# EasyEDA Pro project PCB工程文件.epro

# Schematic 原理图
Board Name: Board1; Create Date: 2025-06-18; Page Name: P1; Project Name: 串口透镜; Schematic Name: 原理图; Update Date: 2025-06-19; Drawed: Fantastair; Page Size: A4; Reviewed: Fantastair; Version: V1.0
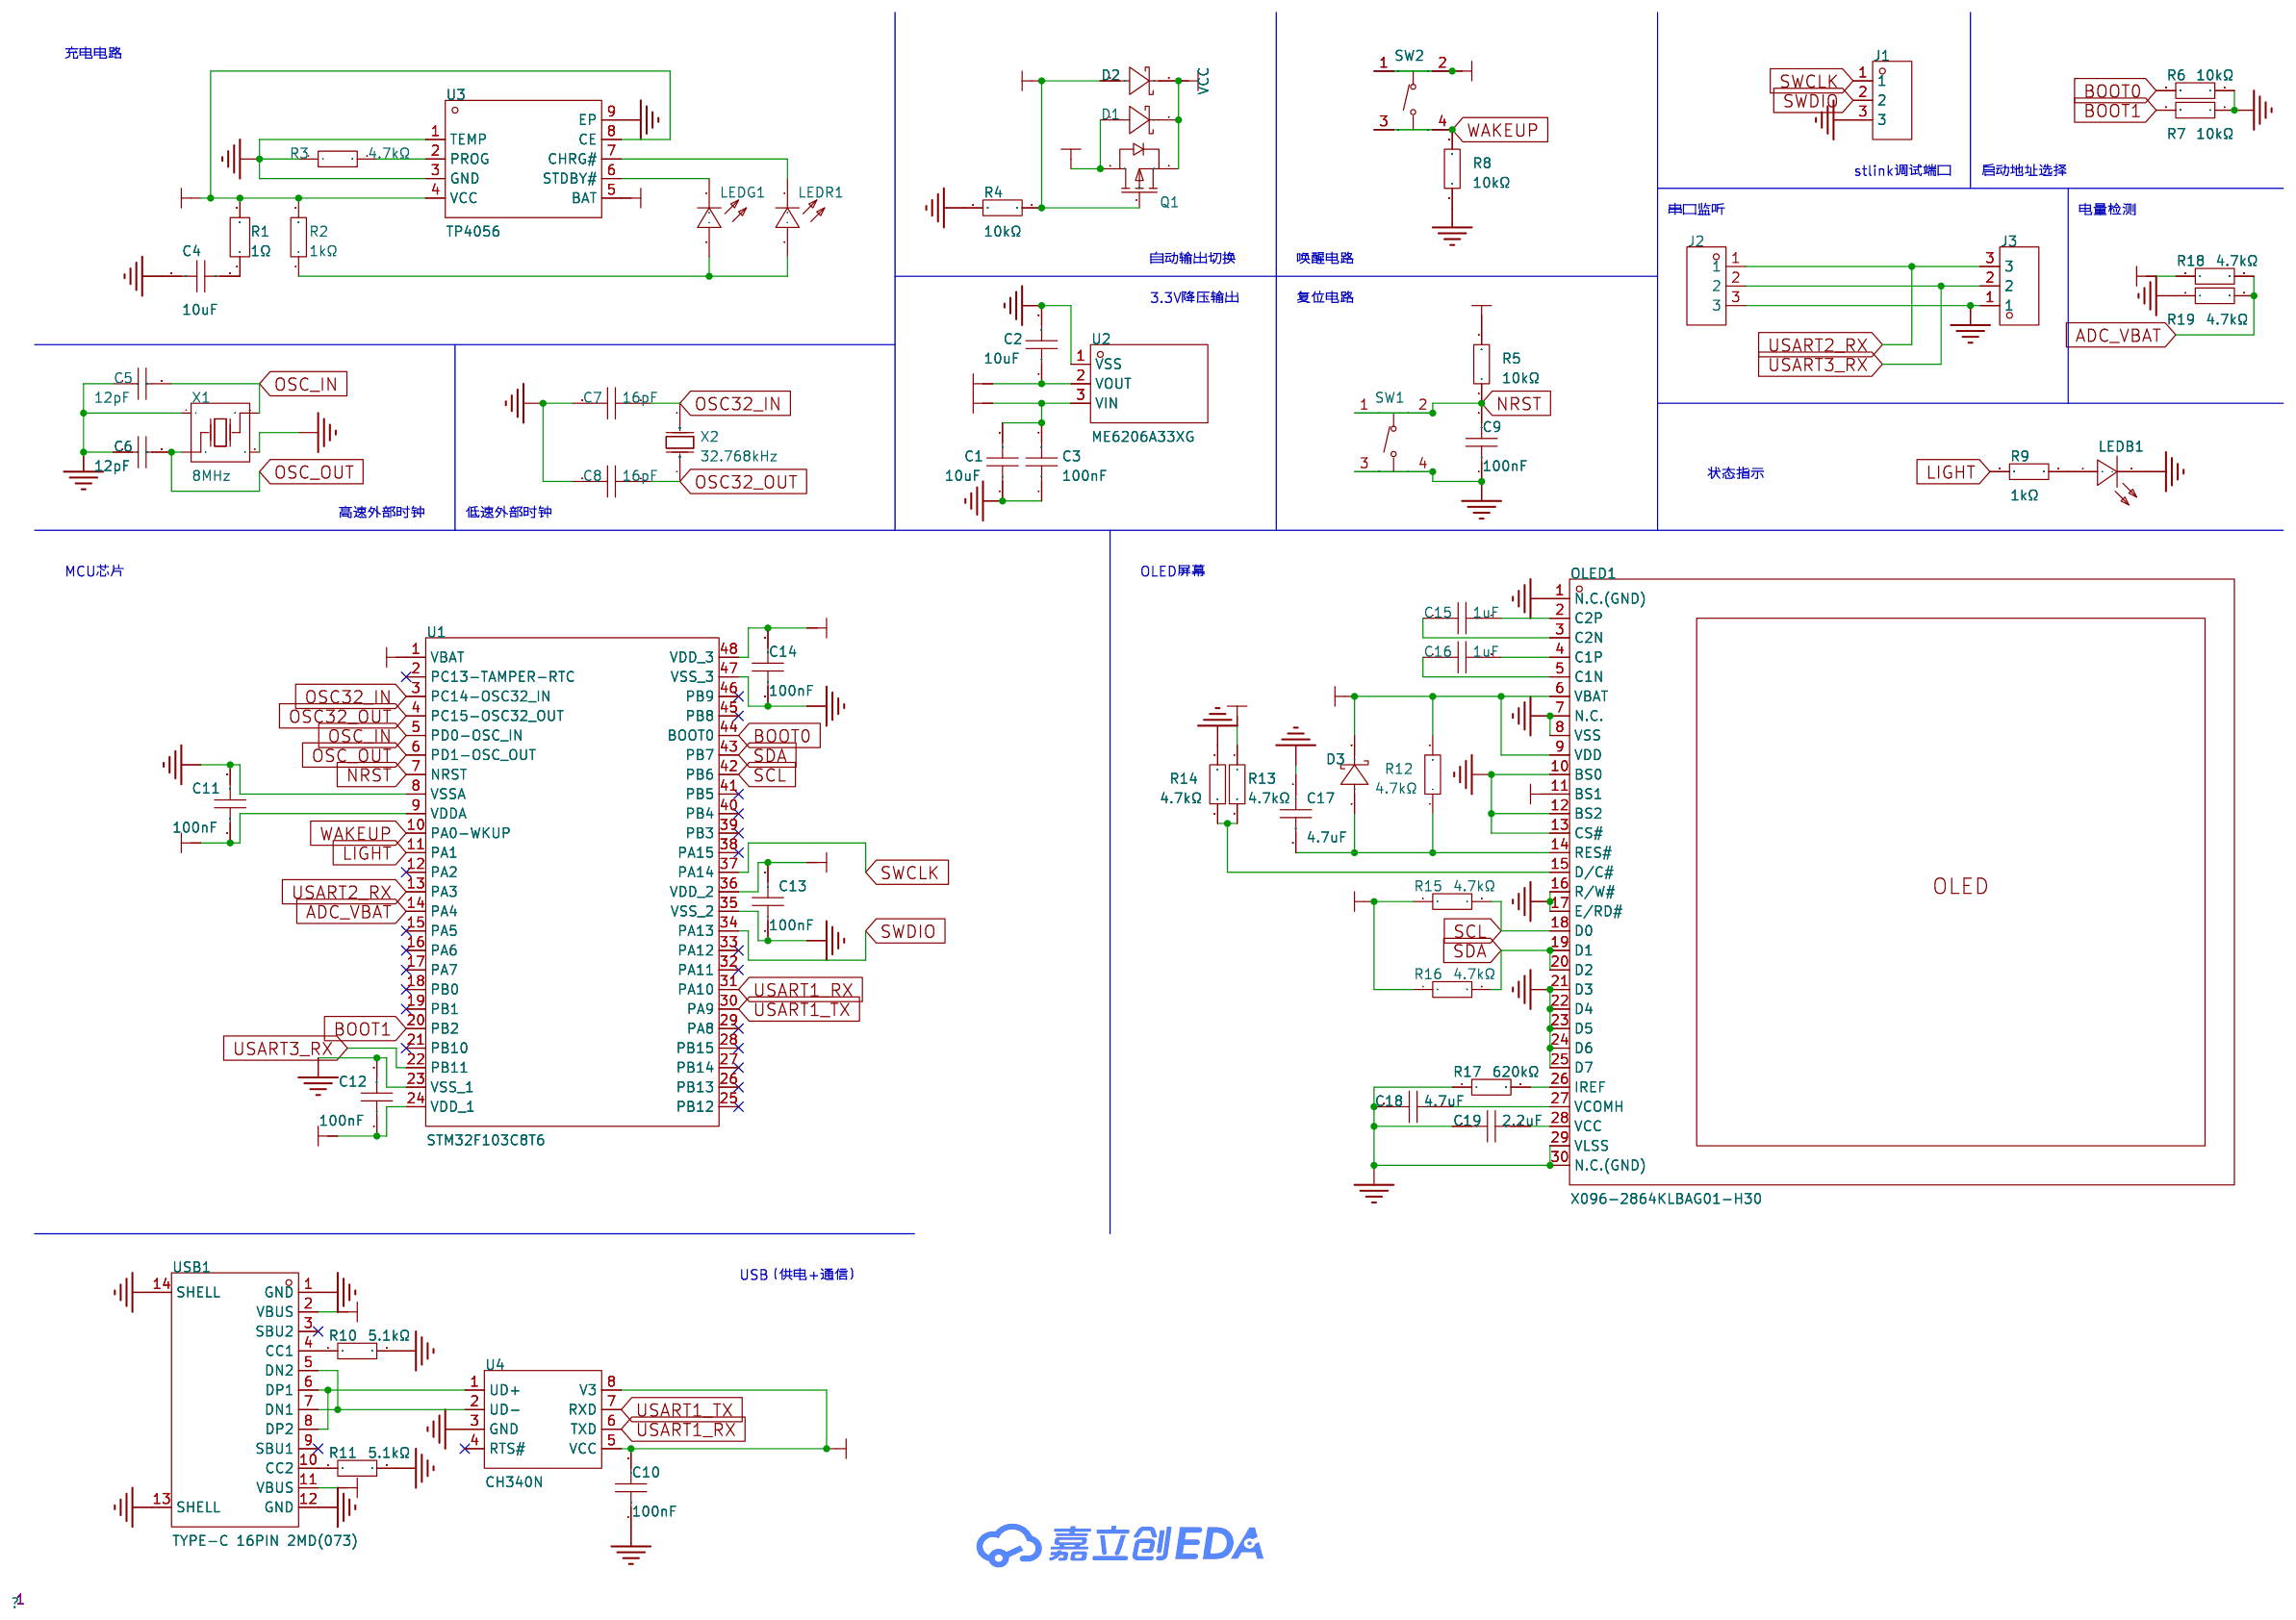
[diagram p0: schematic sheet]

## Parts
C1  10uF  [C0603]
C2  10uF  [C0603]
C3  100nF  [C0603]
C4  10uF  [C0603]
C5  12pF  [C0603]
C6  12pF  [C0603]
C7  16pF  [C0603]
C8  16pF  [C0603]
C9  100nF  [C0603]
C10  100nF  [C0603]
C11  100nF  [C0603]
C12  100nF  [C0603]
C13  100nF  [C0603]
C14  100nF  [C0603]
C15  1uF  [C0603]
C16  1uF  [C0603]
C17  4.7uF  [C0603]
C18  4.7uF  [C0603]
C19  2.2uF  [C0603]
D1  DSK14  [SOD-123_L2.8-W1.8-LS3.7-FD]
D2  DSK14  [SOD-123_L2.8-W1.8-LS3.7-FD]
D3  DSK14  [SOD-123_L2.8-W1.8-LS3.7-FD]
J1  X6511FRS-03-C85D30  [HDR-SMD_3P-P2.54-H-F-L11.5]
J2  X6511FRS-03-C85D30  [HDR-SMD_3P-P2.54-H-F-L11.5]
J3  X6511FRS-03-C85D30  [HDR-SMD_3P-P2.54-H-F-L11.5]
LEDB1  NCD0805B2  [LED0805-R-RD]
LEDG1  NCD0603G1  [LED0603-RD_1]
LEDR1  NCD0603R1  [LED0603-RD_RED]
OLED1  X096-2864KLBAG01-H30  [OLED-SMD_X096-2864KLBAG01-H30]
Q1  SI2301S  [SOT-23-3_L2.9-W1.3-P0.95-LS2.4-BR]
R1  1Ω  [R0603]
R2  1kΩ  [R0603]
R3  4.7kΩ  [R0603]
R4  10kΩ  [R0603]
R5  10kΩ  [R0603]
R6  10kΩ  [R0603]
R7  10kΩ  [R0603]
R8  10kΩ  [R0603]
R9  1kΩ  [R0603]
R10  5.1kΩ  [R0603]
R11  5.1kΩ  [R0603]
R12  4.7kΩ  [R0603]
R13  4.7kΩ  [R0603]
R14  4.7kΩ  [R0603]
R15  4.7kΩ  [R0603]
R16  4.7kΩ  [R0603]
R17  620kΩ  [R0603]
R18  4.7kΩ  [R0603]
R19  4.7kΩ  [R0603]
SW1  TS-1187A-B-A-B  [SW-SMD_4P-L5.1-W5.1-P3.70-LS6.5-TL_H1.5]
SW2  TS-1187A-B-A-B  [SW-SMD_4P-L5.1-W5.1-P3.70-LS6.5-TL_H1.5]
U1  STM32F103C8T6  [LQFP-48_L7.0-W7.0-P0.50-LS9.0-BL]
U2  ME6206A33XG  [SOT-23-3_L2.9-W1.6-P1.90-LS2.8-BR]
U3  TP4056  [ESOP-8_L4.9-W3.9-P1.27-LS6.0-BL-EP]
U4  CH340N  [SOP-8_L4.9-W3.9-P1.27-LS6.0-BL]
USB1  TYPE-C 16PIN 2MD(073)  [USB-C-SMD_TYPE-C-6PIN-2MD-073]
X1  8MHz  [CRYSTAL-SMD_4P-L3.2-W2.5-BL]
X2  32.768kHz  [CRYSTAL-SMD_L3.2-W1.5-1]

## Library data of the parts
C1 C2 C4 = CL10A106KP8NNNC: 容值:10uF;精度:±10%;额定电压:10V;材质(温度系数):X5R;; LCSC Part Name: 10uF ±10% 10V; Supplier Part: C19702; Manufacturer: SAMSUNG(三星); Supplier Footprint: 0603; JLCPCB Part Class: 基础库; Datasheet: https://atta.szlcsc.com/upload/public/pdf/source/20160218/1457707763339.pdf; Supplier: LCSC; Tolerance: ±10%; Voltage Rated: 10V; Temperature Coefficient: X5R
C3 C9-C14 = CGA0603X7R104K500JT: 容值:100nF;精度:±10%;额定电压:50V;温度系数:X7R;; LCSC Part Name: 100nF ±10% 50V; Supplier Part: C6119867; Manufacturer: HRE(芯声); Supplier Footprint: 0603; JLCPCB Part Class: 扩展库; Datasheet: https://atta.szlcsc.com/upload/public/pdf/source/20250103/C44077DA9E7B3EFAE02F22B6D3D1CBC9.pdf; Supplier: LCSC; Tolerance: ±10%; Voltage Rating: 50V; Temperature Coefficient: X7R
C5 C6 = CL10C120JB8NNNC: 容值:12pF;精度:±5%;额定电压:50V;材质(温度系数):C0G;; LCSC Part Name: 12pF ±5% 50V; Supplier Part: C38523; Manufacturer: SAMSUNG(三星); Supplier Footprint: 0603; JLCPCB Part Class: 基础库; Datasheet: https://atta.szlcsc.com/upload/public/pdf/source/20160218/1457707763339.pdf; Supplier: LCSC; Tolerance: ±5%; Voltage Rated: 50V; Temperature Coefficient: C0G
C7 C8 = CC0603JRNPO9BN160: 容值:16pF;精度:±5%;额定电压:50V;材质(温度系数):NP0;; LCSC Part Name: 16pF ±5% 50V; Supplier Part: C327125; Manufacturer: YAGEO(国巨); Supplier Footprint: 0603; JLCPCB Part Class: 扩展库; Datasheet: https://atta.szlcsc.com/upload/public/pdf/source/20181031/C327125_89E7808AEF80EBF49C6D347D2684BD80.pdf; Supplier: LCSC; Tolerance: ±5%; Voltage Rated: 50V; Temperature Coefficient: NP0
C15 C16 = CL10A105KB8NNNC: 容值:1uF;精度:±10%;额定电压:50V;材质(温度系数):X5R;; LCSC Part Name: 1uF ±10% 50V; Supplier Part: C15849; Manufacturer: SAMSUNG(三星); Supplier Footprint: 0603; JLCPCB Part Class: 基础库; Datasheet: https://atta.szlcsc.com/upload/public/pdf/source/20160218/1457707763339.pdf; Supplier: LCSC; Tolerance: ±10%; Voltage Rated: 50V; Temperature Coefficient: X5R
C17 C18 = CL10A475KO8NNNC: 容值:4.7uF;精度:±10%;额定电压:16V;材质(温度系数):X5R;; LCSC Part Name: 4.7uF ±10% 16V; Supplier Part: C19666; Manufacturer: SAMSUNG(三星); Supplier Footprint: 0603; JLCPCB Part Class: 基础库; Datasheet: https://atta.szlcsc.com/upload/public/pdf/source/20160218/1457707763339.pdf; Supplier: LCSC; Tolerance: ±10%; Voltage Rated: 16V; Temperature Coefficient: X5R
C19 = CL10A225KB8NNNC: 容值:2.2uF;精度:±10%;额定电压:50V;材质(温度系数):X5R;; LCSC Part Name: 2.2uF ±10% 50V; Supplier Part: C913904; Manufacturer: SAMSUNG(三星); Supplier Footprint: 0603; JLCPCB Part Class: 扩展库; Datasheet: https://atta.szlcsc.com/upload/public/pdf/source/20160218/1457707763339.pdf; Supplier: LCSC; Tolerance: ±10%; Voltage Rated: 50V; Temperature Coefficient: X5R
D1-D3 = DSK14_C908228: 二极管配置:-;正向压降(Vf):550mV@1A;直流反向耐压(Vr):40V;平均整流电流(Io):1A;; LCSC Part Name: 电压:40V 电流:1A; Supplier Part: C908228; Manufacturer: FUXINSEMI(富芯森美); Supplier Footprint: SOD-123; JLCPCB Part Class: 扩展库; Datasheet: https://atta.szlcsc.com/upload/public/pdf/source/20201027/C908227_56774C7FA3F54032F9E299E0F5E1A587.pdf; Supplier: LCSC; Forward Voltage (Vf@If): 550mV@1A; Reverse Voltage (Vr): 40V; Average Rectified Current (Io): 1A; Reverse Leakage Current (Ir): 500uA
J1-J3 = X6511FRS-03-C85D30: 插孔结构:1x3P;间距:2.54mm;安装类型:卧贴;排数:单排;总孔位数:3P;塑高:8.5mm;; LCSC Part Name: 间距:2.54mm 1x3P 卧贴; Supplier Part: C5142236; Manufacturer: XKB Connectivity(中国星坤); Supplier Footprint: SMD,P=2.54mm,卧贴; JLCPCB Part Class: 扩展库; Datasheet: https://atta.szlcsc.com/upload/public/pdf/source/20220822/AB9A82E80C220285963E5EFA3BFD32FF.pdf; Supplier: LCSC; Holes Structure: 1x3P; Pitch: 2.54mm; Mounting Type: 卧贴; Number of Rows: 单排; Number of Holes: 3P; Insulation Height: 8.5mm
LEDB1 = NCD0805B2: 发光颜色:蓝色;正向电压(VF):2.5V~3.6V;功率:72mW;正向电流:2mA;主波长:468nm~478nm;透镜颜色:无色透明透镜;发光强度:20mcd~55mcd;发光角度:130°;工作温度:-30℃~+85℃;; Supplier Part: C84259; Manufacturer: 国星光电; Supplier Footprint: 0805; JLCPCB Part Class: 扩展库; Datasheet: https://atta.szlcsc.com/upload/public/pdf/source/20200820/C84259_E5AC6865415989C4C2C2831134BA3A23.pdf; Supplier: LCSC; Emitted Color: 蓝色; Forward Voltage (VF): 2.5V~3.6V; Power Dissipation: 72mW; Forward Current: 2mA; Dominant Wavelength: 468nm~478nm; Lens Color: 无色透明透镜; Luminous Intensity: 20mcd~55mcd; Viewing Angle: 130°; Operating Temperature: -30℃~+85℃
LEDG1 = NCD0603G1: 发光颜色:翠绿色;正向压降(Vf):2.6V~3.6V;功率:72mW;正向电流:20mA;波长:515nm~530nm;透镜颜色:-;发光强度:330mcd~900mcd;发光角度:130°;工作温度:-30℃~+85℃;; Supplier Part: C84267; Manufacturer: 国星光电; Supplier Footprint: 0603; JLCPCB Part Class: 扩展库; Datasheet: https://atta.szlcsc.com/upload/public/pdf/source/20200820/C84267_04BA7703640BAC111D09F5EFB971FBF3.pdf; Supplier: LCSC; Illumination Color: 翠绿色; Voltage - Forward(Vf): 2.6V~3.6V; Power(Watts): 72mW; Forward Current: 20mA; Wavelength - Dominant: 515nm~530nm; Luminous Intensity: 330mcd~900mcd; Viewing Angle: 130°; Operating Temperature: -30℃~+85℃
LEDR1 = NCD0603R1_C84263: 灯头类型:-;发光颜色:红色;正向压降(Vf):1.6V~2.6V;功率:65mW;正向电流:25mA;波长:615nm~630nm;二极管配置:独立二极管;透镜颜色:-;色温:-;发光强度:80mcd~220mcd;发光角度:130°;载带方式:-;工作温度:-30℃~+85℃;; Supplier Part: C84263; Manufacturer: 国星光电; Supplier Footprint: 0603; JLCPCB Part Class: 扩展库; Datasheet: https://atta.szlcsc.com/upload/public/pdf/source/20200820/C84263_DABC6A75E58F576973B407FDBA283D60.pdf; Supplier: LCSC; Illumination Color: 红色; Voltage - Forward(Vf): 1.6V~2.6V; Power(Watts): 65mW; Forward Current: 25mA; Wavelength - Dominant: 615nm~630nm; Diode Configuration: 独立二极管; Luminous Intensity: 80mcd~220mcd; Viewing Angle: 130°; Operating Temperature: -30℃~+85℃
OLED1 = X096-2864KLBAG01-H30: 主控芯片:SSD1315;尺寸(inch):0.96;像素分辨率:128x64;; LCSC Part Name: 0.96寸 蓝光 128x64像素分辨率 30PIN; Supplier Part: C4944144; Manufacturer: Newvision(新智景); JLCPCB Part Class: 扩展库; Datasheet: https://atta.szlcsc.com/upload/public/pdf/source/20220811/AFF42A01440844B6AF7EF5D26E15DF13.pdf; Supplier: LCSC; Main Control Chip: SSD1315; Size: 0.96; Pixel Resolution: 128x64; Operating Temperature: -40℃~+85℃
Q1 = SI2301S_C18186231: 类型:-;漏源电压(Vdss):20V;连续漏极电流(Id):2.3A;导通电阻(RDS(on)):142mΩ@2.5V,2A;耗散功率(Pd):-;阈值电压(Vgs(th)):400mV;; LCSC Part Name: 1个P沟道 耐压:20V 电流:2.3A; Supplier Part: C18186231; Manufacturer: GOODWORK(固得沃克); Supplier Footprint: SOT-23; Datasheet: https://atta.szlcsc.com/upload/public/pdf/source/20230919/7D45853AF69EB0E0671E02D1B59DE28B.pdf; Supplier: LCSC; Drain to Source Voltage: 20V; Current - Continuous Drain(Id): 2.3A; RDS(on): 142mΩ@2.5V,2A; Gate Threshold Voltage (Vgs(th)@Id): 400mV; Gate Charge(Qg): 10nC@4.5V; Input Capacitance(Ciss@Vds): 405pF; Reverse Transfer Capacitance (Crss@Vds): 55pF; Operating Temperature: -50℃~+150℃
R1 = FRC0603J1R0 TS: 电阻类型:厚膜电阻;阻值:1Ω;精度:±5%;功率:100mW;最大工作电压:75V;温度系数:±200ppm/℃;; LCSC Part Name: 1Ω ±5% 100mW 厚膜电阻; Supplier Part: C2907116; Manufacturer: FOJAN(富捷); Supplier Footprint: 0603; JLCPCB Part Class: 扩展库; Datasheet: https://atta.szlcsc.com/upload/public/pdf/source/20211221/925EC7D7225764EE0046F22065062C87.pdf; Supplier: LCSC; Type: 厚膜电阻; Tolerance: ±5%; Power(Watts): 100mW; Overload Voltage (Max): 75V; Temperature Coefficient: ±200ppm/℃; Operating Temperature Range: -55℃~+155℃
R2 R9 = 0603WAF1001T5E: 电阻类型:厚膜电阻;阻值:1kΩ;精度:±1%;功率:100mW;最大工作电压:75V;温度系数:±100ppm/℃;; LCSC Part Name: 1kΩ ±1% 100mW 厚膜电阻; Supplier Part: C21190; Manufacturer: UNI-ROYAL(厚声); Supplier Footprint: 0603; JLCPCB Part Class: 基础库; Datasheet: https://atta.szlcsc.com/upload/public/pdf/source/20200306/C422600_1E6D84923E4A46A82E41ADD87F860B5C.pdf; Supplier: LCSC; Type: 厚膜电阻; Tolerance: ±1%; Power(Watts): 100mW; Overload Voltage (Max): 75V; Temperature Coefficient: ±100ppm/℃; Operating Temperature Range: -55℃~+155℃
R3 R12-R16 R18 R19 = 0603WAF4701T5E: 电阻类型:厚膜电阻;阻值:4.7kΩ;精度:±1%;功率:100mW;最大工作电压:75V;温度系数:±100ppm/℃;; LCSC Part Name: 4.7kΩ ±1% 100mW 厚膜电阻; Supplier Part: C23162; Manufacturer: UNI-ROYAL(厚声); Supplier Footprint: 0603; JLCPCB Part Class: 基础库; Datasheet: https://atta.szlcsc.com/upload/public/pdf/source/20200306/C422600_1E6D84923E4A46A82E41ADD87F860B5C.pdf; Supplier: LCSC; Type: 厚膜电阻; Tolerance: ±1%; Power(Watts): 100mW; Overload Voltage (Max): 75V; Temperature Coefficient: ±100ppm/℃; Operating Temperature Range: -55℃~+155℃
R4-R8 = 0603WAF1002T5E: 电阻类型:厚膜电阻;阻值:10kΩ;精度:±1%;功率:100mW;最大工作电压:75V;温度系数:±100ppm/℃;; LCSC Part Name: 厚膜电阻 10kΩ ±1% 100mW; Supplier Part: C25804; Manufacturer: UNI-ROYAL(厚声); Supplier Footprint: 0603; JLCPCB Part Class: 基础库; Datasheet: https://atta.szlcsc.com/upload/public/pdf/source/20200306/C422600_1E6D84923E4A46A82E41ADD87F860B5C.pdf; Supplier: LCSC; Type: 厚膜电阻; Tolerance: ±1%; Power(Watts): 100mW; Overload Voltage (Max): 75V; Temperature Coefficient: ±100ppm/℃; Operating Temperature Range: -55℃~+155℃
R10 R11 = ETCR0603F5K10K9: 阻值:5.1kΩ;精度:±1%;功率:100mW;; LCSC Part Name: 5.1kΩ ±1% 100mW; Supplier Part: C365441; Manufacturer: RESI(开步睿思); Supplier Footprint: 0603; JLCPCB Part Class: 扩展库; Datasheet: https://atta.szlcsc.com/upload/public/pdf/source/20190121/C365476_1D4B5F4656D455B591196F27522394C2.pdf; Supplier: LCSC; Tolerance: ±1%; Power(Watts): 100mW
R17 = 0603WAF6203T5E: 电阻类型:厚膜电阻;阻值:620kΩ;精度:±1%;功率:100mW;最大工作电压:75V;温度系数:±100ppm/℃;; LCSC Part Name: 620kΩ ±1% 100mW 厚膜电阻; Supplier Part: C23219; Manufacturer: UNI-ROYAL(厚声); Supplier Footprint: 0603; JLCPCB Part Class: 扩展库; Datasheet: https://atta.szlcsc.com/upload/public/pdf/source/20200306/C422600_1E6D84923E4A46A82E41ADD87F860B5C.pdf; Supplier: LCSC; Type: 厚膜电阻; Tolerance: ±1%; Power(Watts): 100mW; Overload Voltage (Max): 75V; Temperature Coefficient: ±100ppm/℃; Operating Temperature Range: -55℃~+155℃
SW1 SW2 = TS-1187A-B-A-B: 电路结构:单刀单掷;按钮形状:圆形按钮;作用力:160gf;安装方式:立贴;开关长度:5.1mm;开关宽度:5.1mm;开关高度:1.5mm;带支架:不带;触点电流:50mA;额定电压(DC):12V;绝缘电阻:-;带灯:无;机械寿命:10万次;; LCSC Part Name: 5.1*5.1*1.5mm 立贴 轻触开关; Supplier Part: C318884; Manufacturer: XKB Connectivity(中国星坤); Supplier Footprint: SMD; JLCPCB Part Class: 基础库; Datasheet: https://atta.szlcsc.com/upload/public/pdf/source/20200227/C318890_053E50208A88A7BA1965D8746000774E.pdf; Supplier: LCSC; Circuit: 单刀单掷; Actuator Style: 圆形按钮; Operating Force: 160gf; Mounting Style: 立贴; Switch Length: 5.1mm; Switch Width: 5.1mm; Switch Height: 1.5mm; Strike Gundam: 不带; Contact Current: 50mA; Voltage Rating (DC): 12V; Actuator/Cap Color: 金色; With Lamp: 无; Mechanical Life: 10万次; Operating Temperature: -30℃~+85℃
U1 = STM32F103C8T6: CPU内核:ARM-M3;CPU最大主频:72MHz;应用领域:-;; LCSC Part Name: 主流增强型ARM Cortex-M3 MCU，具有64 KB Flash、72 MHz CPU、电机控制、USB和CAN; Supplier Part: C8734; Manufacturer: ST(意法半导体); Supplier Footprint: LQFP-48(7x7); JLCPCB Part Class: 扩展库; Datasheet: https://atta.szlcsc.com/upload/public/pdf/source/20220812/8363ACEC51AD55ECEB84799464F7CB85.pdf; Supplier: LCSC; CPU Core: ARM-M3; CPU Maximum Speed: 72MHz; Program Storage Size: 64KB; Program Memory Type: FLASH; Number of I/O: 37; ADC (Bit): 12bit; Voltage - Supply: 2V~3.6V
U2 = ME6206A33XG: 输出类型:固定;最大输入电压:6V;输出电压:3.3V;最大输出电流:300mA;电源纹波抑制比(PSRR):50dB@(1kHz);输出极性:正极;; LCSC Part Name: 输入6V 输出3.3V 300mA; Supplier Part: C161345; Manufacturer: MICRONE(南京微盟); Supplier Footprint: SOT-23; JLCPCB Part Class: Extended Part; Datasheet: https://atta.szlcsc.com/upload/public/pdf/source/20180207/C161345_15179949863651359188.pdf; Supplier: LCSC; Output Type: 固定; Maximum Input Voltage: 6V; Output Voltage: 3.3V; MAX Output Current: 300mA; Power Supply Rejection Ratio (PSRR): 50dB@(1kHz); Dropout Voltage: 400mV@(200mA); Output Polarity: 正极; Number of Outputs: 1
U3 = TP4056_C382139: 工作电压:4V~6V;最大充电电流:1A;电池类型:锂离子/聚合物;电池节数:1;; LCSC Part Name: 1A锂电池充电IC; Supplier Part: C382139; Manufacturer: TPOWER(天源); Supplier Footprint: ESOP-8; JLCPCB Part Class: 扩展库; Datasheet: https://atta.szlcsc.com/upload/public/pdf/source/20190327/C382139_EC85960E6FE3E26856C240C81751A184.pdf; Supplier: LCSC; The Chip Type: 线性充电芯片; Supply Voltage: 4V~6V; Maximum Charge Current: 1A; Charging Saturation Voltage: 4.2V; Type of Battery: 锂离子/聚合物; Number of Cells: 1; Operating Temperature: -40℃~+85℃
U4 = CH340N: 应用功能:USB转串口;接口协议:USB 2.0;通道数:1;数据速率:2Mbps;; LCSC Part Name: USB2.0芯片CH340; Supplier Part: C2977777; Manufacturer: WCH(南京沁恒); Supplier Footprint: SOP-8; JLCPCB Part Class: 扩展库; Datasheet: https://atta.szlcsc.com/upload/public/pdf/source/20240313/115CDE92081B1D6CB446704AD5D0F5F2.pdf; Supplier: LCSC; Applications Function: USB转串口; Protocol: USB 2.0; Number of Channels: 1; Voltage - Supply: 3.3V；5V; Data Rate: 2Mbps; Operating Temperature: -20℃~+70℃
USB1 = TYPE-C 16PIN 2MD(073): 连接器类型:Type-C;标准:USB 3.1;公母:母;安装方式:卧贴;触点数量:16P;端口数量:1;额定电流 - 电源:5A;工作温度范围:-25℃~+85℃;; LCSC Part Name: Type-C 母 卧贴; Supplier Part: C2765186; Manufacturer: SHOU HAN(首韩); Supplier Footprint: SMD; JLCPCB Part Class: Extended Part; Datasheet: https://atta.szlcsc.com/upload/public/pdf/source/20211123/39B17C16241EAC15C5E277BDA434118E.pdf; Supplier: LCSC; Connector Type: Type-C; Standard: USB 3.1; Gender: 母; Mounting Style: 卧贴; Number of Contacts: 16P; Number of Ports: 1; Current Rating - Power (Max): 5A; Operating Temperature Range: -25℃~+85℃; Rated Voltage (Max): 5V; Connect-Disconnect Life: 5千次; Core Colour: 黑色
X1 = TAXM8M4RDBCCT2T: 晶振类型:贴片晶振;频率:8MHz;常温频差:±10ppm;负载电容:10pF;频率稳定度:±15ppm;; LCSC Part Name: 8MHz ±10ppm 10pF; Supplier Part: C400090; Manufacturer: YJX(雅晶鑫); Supplier Footprint: SMD3225-4P; JLCPCB Part Class: 扩展库; Datasheet: https://atta.szlcsc.com/upload/public/pdf/source/20190626/C400090_CF95B89E745AFE4EF2E392EF8AC009D6.pdf; Supplier: LCSC; Type: 贴片晶振; Normal temperature Frequency Tolerance: ±10ppm; Load Capacitance: 10pF; Frequency Stability: ±15ppm; Equivalent Series Resistance(ESR): 250Ω; Operating Temperature: -40℃~+85℃
X2 = XKXGI-SUA-32.768K: 晶振类型:贴片晶振;频率:32.768kHz;常温频差:±20ppm;负载电容:12.5pF;频率稳定度:±30ppm;; LCSC Part Name: YST310S 32.768KHZ 2P 3215 12.5PF ±20PPM -40~85℃; Supplier Part: C5213671; Manufacturer: YXC(扬兴晶振); Supplier Footprint: SMD3215-2P; JLCPCB Part Class: 扩展库; Datasheet: https://atta.szlcsc.com/upload/public/pdf/source/20240329/3A7650FD985DD0DE85694D3785AB4916.pdf; Supplier: LCSC; Type: 贴片晶振; Normal temperature Frequency Tolerance: ±20ppm; Load Capacitance: 12.5pF; Frequency Stability: ±30ppm; Operating Temperature: -40℃~+85℃

## Nets
3V3: C2.1 C10.2 C11.1 C12.1 C13.2 C14.2 D3.2(K) OLED1.6(VBAT) OLED1.9(VDD) OLED1.11(BS1) R5.2 R12.2 R13.1 R15.1 R16.1 SW2.1(A) SW2.2(B) U1.1(VBAT) U1.9(VDDA) U1.24(VDD_1) U1.36(VDD_2) U1.48(VDD_3) U2.2(VOUT) U4.5(VCC) U4.8(V3)
5V: D2.1(A) Q1.1(G) R1.2 R2.2 R4.1 U3.4(VCC) U3.8(CE) USB1.2(VBUS) USB1.11(VBUS)
GND: C1.1 C2.2 C3.1 C4.2 C5.1 C6.1 C7.2 C8.2 C9.1 C10.1 C11.2 C12.2 C13.1 C14.1 C17.1 C18.2 C19.1 J1.3 J2.3 J3.1 LEDB1.2(-) OLED1.1(N.C.(GND)) OLED1.7(N.C.) OLED1.8(VSS) OLED1.10(BS0) OLED1.12(BS2) OLED1.13(CS#) OLED1.16(R/W#) OLED1.17(E/RD#) OLED1.21(D3) OLED1.22(D4) OLED1.23(D5) OLED1.24(D6) OLED1.25(D7) OLED1.29(VLSS) OLED1.30(N.C.(GND)) R3.1 R4.2 R6.1 R7.1 R8.1 R10.2 R11.2 R14.1 R17.1 R19.1 SW1.3(C) SW1.4(D) U1.8(VSSA) U1.23(VSS_1) U1.35(VSS_2) U1.47(VSS_3) U2.1(VSS) U3.1(TEMP) U3.3(GND) U3.9(EP) U4.3(GND) USB1.1(GND) USB1.12(GND) USB1.13(SHELL) USB1.14(SHELL) X1.2 X1.4
VCC: C1.2 C3.2 D1.2(K) D2.2(K) Q1.2(S) U2.3(VIN)
ADC_VBAT: R18.2 R19.2 U1.14(PA4)
BOOT0: R6.2 U1.44(BOOT0)
BOOT1: R7.2 U1.20(PB2)
LIGHT: R9.2 U1.11(PA1)
NRST: C9.2 R5.1 SW1.1(A) SW1.2(B) U1.7(NRST)
OSC32_IN: C7.1 U1.3(PC14-OSC32_IN) X2.2(OSC2)
OSC32_OUT: C8.1 U1.4(PC15-OSC32_OUT) X2.1(OSC1)
OSC_IN: C5.2 U1.5(PD0-OSC_IN) X1.3
OSC_OUT: C6.2 U1.6(PD1-OSC_OUT) X1.1
SCL: OLED1.18(D0) R15.2 U1.42(PB6)
SDA: OLED1.19(D1) OLED1.20(D2) R16.2 U1.43(PB7)
SWCLK: J1.1 U1.37(PA14)
SWDIO: J1.2 U1.34(PA13)
USART1_RX: U1.31(PA10) U4.6(TXD)
USART1_TX: U1.30(PA9) U4.7(RXD)
USART2_RX: J2.1 J3.3 U1.13(PA3)
USART3_RX: J2.2 J3.2 U1.22(PB11)
V_BAT: D1.1(A) Q1.3(D) R18.1 U3.5(BAT)
WAKEUP: R8.2 SW2.3(C) SW2.4(D) U1.10(PA0-WKUP)
$1N1063: C4.1 R1.1
$1N1376: LEDG1.2(A) LEDR1.2(A) R2.1
$1N1506: R3.2 U3.2(PROG)
$1N2036: LEDR1.1(K) U3.7(CHRG#)
$1N2050: LEDG1.1(K) U3.6(STDBY#)
$1N6021: LEDB1.1(+) R9.1
$1N7835: R10.1 USB1.4(CC1)
$1N7870: R11.1 USB1.10(CC2)
$1N7941: U4.1(UD+) USB1.6(DP1) USB1.8(DP2)
$1N7951: U4.2(UD-) USB1.5(DN2) USB1.7(DN1)
$1N11036: C15.2 OLED1.2(C2P)
$1N11072: C16.2 OLED1.4(C1P)
$1N11110: C15.1 OLED1.3(C2N)
$1N11115: C16.1 OLED1.5(C1N)
$1N11234: C17.2 D3.1(A) OLED1.14(RES#) R12.1
$1N11475: OLED1.15(D/C#) R13.2 R14.2
$1N11833: OLED1.26(IREF) R17.2
$1N11913: C18.1 OLED1.27(VCOMH)
$1N12059: C19.2 OLED1.28(VCC)

Not connected (* = marked no-connect by the designer): U1 2(PC13-TAMPER-RTC)* 12(PA2)* 15(PA5)* 16(PA6)* 17(PA7)* 18(PB0)* 19(PB1)* 21(PB10)* 25(PB12)* 26(PB13)* 27(PB14)* 28(PB15)* 29(PA8)* 32(PA11)* 33(PA12)* 38(PA15)* 39(PB3)* 40(PB4)* 41(PB5)* 45(PB8)* 46(PB9)*; U4 4(RTS#)*; USB1 3(SBU2)* 9(SBU1)*

## Notes on the sheet
- 充电电路
- stlink调试端口
- 启动地址选择
- 串口监听
- 电量检测
- 自动输出切换
- 唤醒电路
- 3.3V降压输出
- 复位电路
- 状态指示
- 高速外部时钟
- 低速外部时钟
- MCU芯片
- OLED屏幕
- USB（供电+通信）

# Board Board1
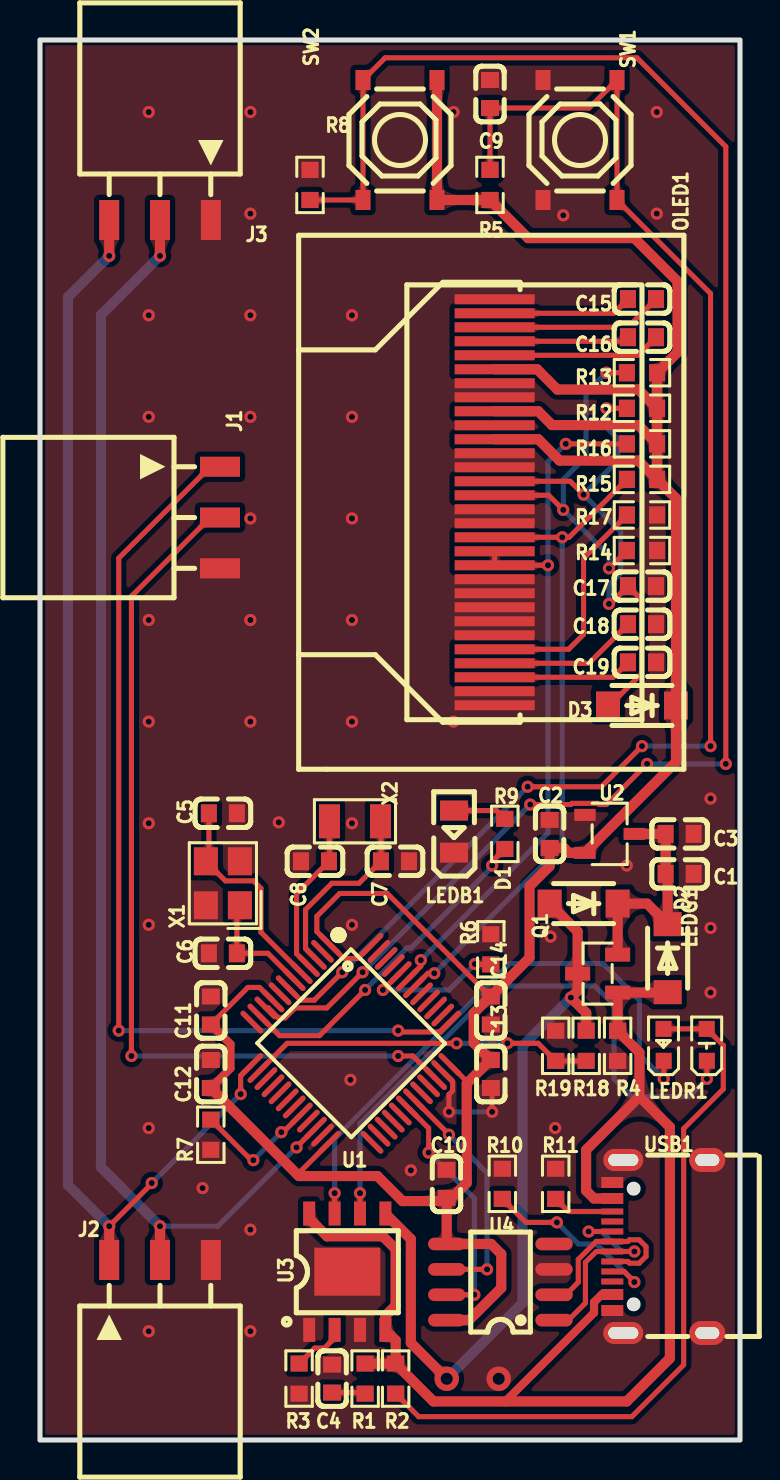
[diagram p1: board, top side]
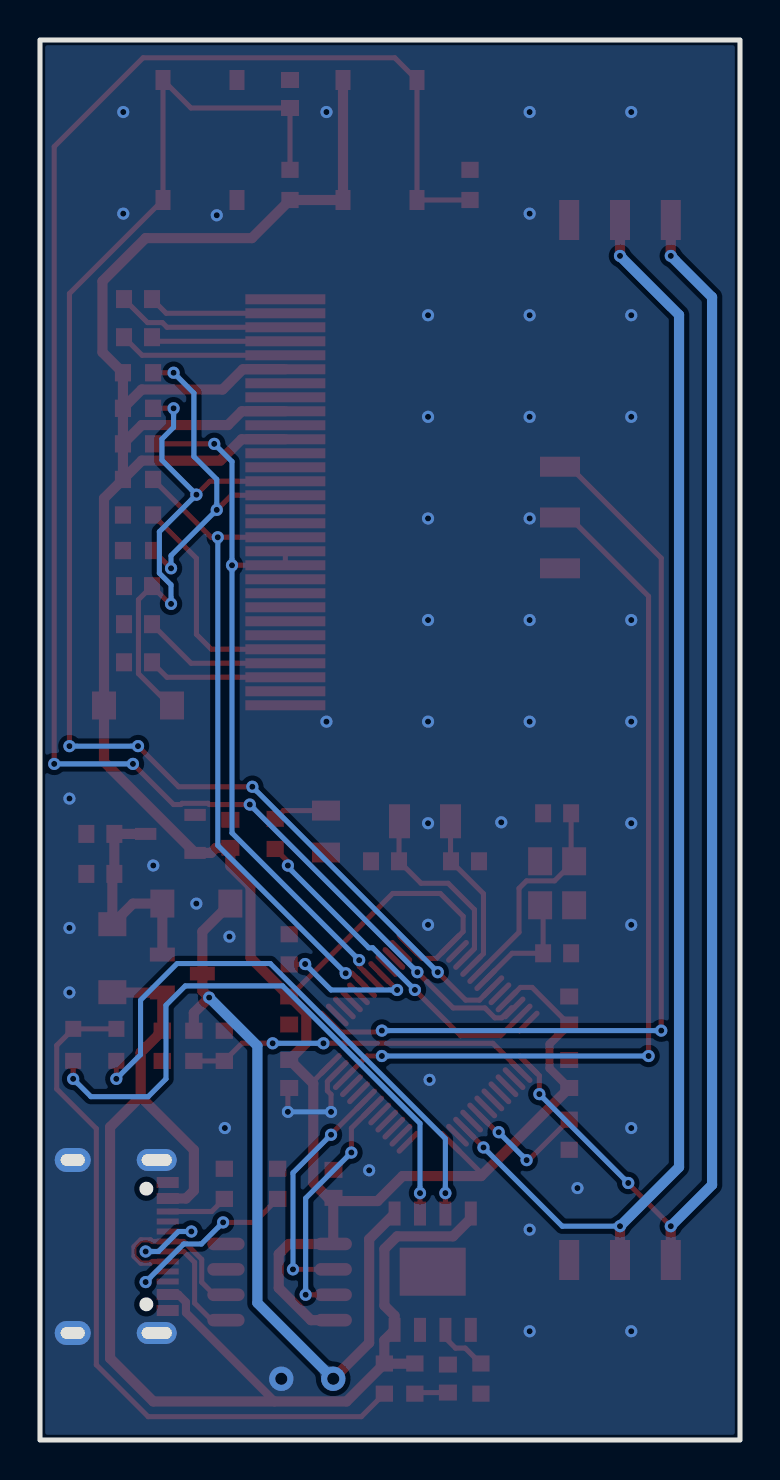
[diagram p2: board, bottom side, seen from below]

Outline 35 x 70 mm; copper layers: Top Layer, Bottom Layer. Coordinates in mm from the lower left corner of the outline.
Outline path: rectangle 0,70 35,0
Stack: Top Layer 0.035mm / Dielectric1 1.51mm FR4 er 4.5 / Bottom Layer 0.035mm

## Design rules (mm)
template: 自定义配置
spacing copperThickness1oz (default): track to track 0.102, other pairs 0.152 to 0.3
spacing copperThickness2oz: track to track 0.203, other pairs 0.152 to 0.3
track width copperThickness1oz (default): min 0.127, default 0.254, max 2.54
track width copperThickness2oz: min 0.203, default 0.254, max 2.54
differential pair differentialPair (default): width min 0.127, default 0.254, max 2.54; gap min 0.152, default 0.152
via viaSize (default): diameter min 0.5, default 0.61, max 10; hole min 0.3, default 0.305, max 6.3
net GND uses copperRegion1
pour e2064 uses copperRegion1

## Placement (name value [footprint] x y rotation side)
C1  10uF  [C0603]  31.98 28.31 180 top
C2  10uF  [C0603]  25.48 30.31 90 top
C3  100nF  [C0603]  31.98 30.31 180 top
C4  10uF  [C0603]  14.6 3.07 90 top
C5  12pF  [C0603]  9.14 31.34 180 top
C6  12pF  [C0603]  9.14 24.34 0 top
C7  16pF  [C0603]  17.75 28.94 0 top
C8  16pF  [C0603]  13.75 28.94 180 top
C9  100nF  [C0603]  22.5 67.3 270 top
C10  100nF  [C0603]  20.32 12.81 270 top
C11  100nF  [C0603]  8.54 21.48 90 top
C12  100nF  [C0603]  8.54 18.3 90 top
C13  100nF  [C0603]  22.54 18.3 90 top
C14  100nF  [C0603]  22.54 21.48 90 top
C15  1uF  [C0603]  30.1 57.05 180 top
C16  1uF  [C0603]  30.1 55.14 180 top
C17  4.7uF  [C0603]  30.1 42.69 180 top
C18  4.7uF  [C0603]  30.1 40.79 0 top
C19  2.2uF  [C0603]  30.1 38.89 180 top
D1  DSK14  [SOD-123_L2.8-W1.8-LS3.7-FD]  27.18 26.82 0 top
D2  DSK14  [SOD-123_L2.8-W1.8-LS3.7-FD]  31.38 24.09 90 top
D3  DSK14  [SOD-123_L2.8-W1.8-LS3.7-FD]  30.1 36.73 0 top
J1  X6511FRS-03-C85D30  [HDR-SMD_3P-P2.54-H-F-L11.5]  9 46.12 270 top
J2  X6511FRS-03-C85D30  [HDR-SMD_3P-P2.54-H-F-L11.5]  6 9 0 top
J3  X6511FRS-03-C85D30  [HDR-SMD_3P-P2.54-H-F-L11.5]  6 61 180 top
LEDB1  NCD0805B2  [LED0805-R-RD]  20.7 30.42 90 top
LEDG1  NCD0603G1  [LED0603-RD_1]  33.34 19.76 90 top
LEDR1  NCD0603R1  [LED0603-RD_RED]  31.18 19.76 90 top
OLED1  X096-2864KLBAG01-H30  [OLED-SMD_X096-2864KLBAG01-H30]  22.73 46.89 270 top
Q1  SI2301S  [SOT-23-3_L2.9-W1.3-P0.95-LS2.4-BR]  27.88 23.32 0 top
R1  1Ω  [R0603]  16.26 3.07 90 top
R2  1kΩ  [R0603]  17.78 3.07 90 top
R3  4.7kΩ  [R0603]  12.95 3.07 90 top
R4  10kΩ  [R0603]  28.88 19.71 270 top
R5  10kΩ  [R0603]  22.5 62.75 270 top
R6  10kΩ  [R0603]  22.54 24.53 270 top
R7  10kΩ  [R0603]  8.54 15.26 90 top
R8  10kΩ  [R0603]  13.5 62.75 270 top
R9  1kΩ  [R0603]  23.24 30.31 270 top
R10  5.1kΩ  [R0603]  23.12 12.81 90 top
R11  5.1kΩ  [R0603]  25.78 12.81 90 top
R12  4.7kΩ  [R0603]  30.1 51.58 0 top
R13  4.7kΩ  [R0603]  30.1 53.36 180 top
R14  4.7kΩ  [R0603]  30.1 44.47 180 top
R15  4.7kΩ  [R0603]  30.1 48.03 180 top
R16  4.7kΩ  [R0603]  30.1 49.81 180 top
R17  620kΩ  [R0603]  30.1 46.25 180 top
R18  4.7kΩ  [R0603]  27.31 19.71 270 top
R19  4.7kΩ  [R0603]  25.78 19.71 270 top
SW1  TS-1187A-B-A-B  [SW-SMD_4P-L5.1-W5.1-P3.70-LS6.5-TL_H1.5]  27 65 270 top
SW2  TS-1187A-B-A-B  [SW-SMD_4P-L5.1-W5.1-P3.70-LS6.5-TL_H1.5]  18 65 270 top
U1  STM32F103C8T6  [LQFP-48_L7.0-W7.0-P0.50-LS9.0-BL]  15.54 19.83 225 top
U2  ME6206A33XG  [SOT-23-3_L2.9-W1.6-P1.90-LS2.8-BR]  28.48 30.31 180 top
U3  TP4056  [ESOP-8_L4.9-W3.9-P1.27-LS6.0-BL-EP]  15.37 8.41 0 top
U4  CH340N  [SOP-8_L4.9-W3.9-P1.27-LS6.0-BL]  23.02 7.9 90 top
USB1  TYPE-C 16PIN 2MD(073)  [USB-C-SMD_TYPE-C-6PIN-2MD-073]  30.99 9.68 90 top
X1  8MHz  [CRYSTAL-SMD_4P-L3.2-W2.5-BL]  9.14 27.84 90 top
X2  32.768kHz  [CRYSTAL-SMD_L3.2-W1.5-1]  15.75 30.94 0 top

## Footprints (pads in the part's own frame, mm; a bottom-side part is the same pattern mirrored in y, then rotated)
C0603
  rect 0.8x0.9 smd: 1(-0.7,0) 2(0.7,0)
CRYSTAL-SMD_4P-L3.2-W2.5-BL
  rect 1.4x1.2 smd: 1(-1.1,-0.85) 2(1.1,-0.85) 3(1.1,0.85) 4(-1.1,0.85)
CRYSTAL-SMD_L3.2-W1.5-1
  rect 1.05x1.7 smd: 1(-1.275,0) 2(1.275,0)
ESOP-8_L4.9-W3.9-P1.27-LS6.0-BL-EP
  rect 0.6x1.2 smd: 1(-1.905,-2.909) 2(-0.635,-2.909) 3(0.635,-2.909) 4(1.905,-2.909) 5(1.905,2.909) 6(0.635,2.909) 7(-0.635,2.909) 8(-1.905,2.909)
  rect 3.3x2.4 smd: 9(0,0)
HDR-SMD_3P-P2.54-H-F-L11.5
  rect 1x2 smd: 1(-2.54,0) 2(0,0) 3(2.54,0)
LED0603-RD_1
  rect 0.8x0.8 smd: 1(-0.799,-0.004) 2(0.799,0.004)
LED0603-RD_RED
  rect 0.8x0.8 smd: 1(-0.799,-0.004) 2(0.799,0.004)
LED0805-R-RD
  rect 1x1.399 smd: 1(1.05,0) 2(-1.05,0)
LQFP-48_L7.0-W7.0-P0.50-LS9.0-BL
  oval 0.27x1.5 smd: 1(-2.75,-4.25) 2(-2.25,-4.25) 3(-1.75,-4.25) 4(-1.25,-4.25) 5(-0.75,-4.25) 6(-0.25,-4.25) 7(0.25,-4.25) 8(0.75,-4.25) 9(1.25,-4.25) 10(1.75,-4.25) 11(2.25,-4.25) 12(2.75,-4.25) 25(2.75,4.25) 26(2.25,4.25) 27(1.75,4.25) 28(1.25,4.25) 29(0.75,4.25) 30(0.25,4.25) 31(-0.25,4.25) 32(-0.75,4.25) 33(-1.25,4.25) 34(-1.75,4.25) 35(-2.25,4.25) 36(-2.75,4.25)
  oval 1.5x0.27 smd: 13(4.25,-2.75) 14(4.25,-2.25) 15(4.25,-1.75) 16(4.25,-1.25) 17(4.25,-0.75) 18(4.25,-0.25) 19(4.25,0.25) 20(4.25,0.75) 21(4.25,1.25) 22(4.25,1.75) 23(4.25,2.25) 24(4.25,2.75) 37(-4.25,2.75) 38(-4.25,2.25) 39(-4.25,1.75) 40(-4.25,1.25) 41(-4.25,0.75) 42(-4.25,0.25) 43(-4.25,-0.25) 44(-4.25,-0.75) 45(-4.25,-1.25) 46(-4.25,-1.75) 47(-4.25,-2.25) 48(-4.25,-2.75)
OLED-SMD_X096-2864KLBAG01-H30
  rect 0.5x4 smd: 1(-10.15,0) 2(-9.45,0) 3(-8.75,0) 4(-8.05,0) 5(-7.35,0) 6(-6.65,0) 7(-5.95,0) 8(-5.25,0) 9(-4.55,0) 10(-3.85,0) 11(-3.15,0) 12(-2.45,0) 13(-1.75,0) 14(-1.05,0) 15(-0.35,0) 16(0.35,0) 17(1.05,0) 18(1.75,0) 19(2.45,0) 20(3.15,0) 21(3.85,0) 22(4.55,0) 23(5.25,0) 24(5.95,0) 25(6.65,0) 26(7.35,0) 27(8.05,0) 28(8.75,0) 29(9.45,0) 30(10.15,0)
R0603
  rect 0.806x0.864 smd: 1(-0.753,0) 2(0.753,0)
SOD-123_L2.8-W1.8-LS3.7-FD
  rect 1.2x1.4 smd: 1(-1.7,0) 2(1.7,0)
SOP-8_L4.9-W3.9-P1.27-LS6.0-BL
  oval 0.63x1.865 smd: 1(-1.905,-2.683) 2(-0.635,-2.683) 3(0.635,-2.683) 4(1.905,-2.683) 5(1.905,2.683) 6(0.635,2.683) 7(-0.635,2.683) 8(-1.905,2.683)
SOT-23-3_L2.9-W1.3-P0.95-LS2.4-BR
  rect 1.25x0.7 smd: 1(1,-0.95) 2(1,0.95) 3(-1,0)
SOT-23-3_L2.9-W1.6-P1.90-LS2.8-BR
  rect 1.07x0.6 smd: 1(1.235,-0.95) 2(1.235,0.95) 3(-1.235,0)
SW-SMD_4P-L5.1-W5.1-P3.70-LS6.5-TL_H1.5
  rect 1x0.75 smd: 1(-3,1.85) 2(3,1.85) 3(-3,-1.85) 4(3,-1.85)
USB-C-SMD_TYPE-C-6PIN-2MD-073
  rect 0.55x1.1 smd: 1(-3.2,2.375) 2(-2.4,2.375) 11(2.4,2.375) 12(3.2,2.375)
  rect 0.3x1.1 smd: 3(-1.75,2.375) 4(-1.25,2.375) 5(-0.75,2.375) 6(-0.25,2.375) 7(0.25,2.375) 8(0.75,2.375) 9(1.25,2.375) 10(1.75,2.375)
  oval 1.1x2 hole 0.6x1.5: 13(-4.325,1.825) 14(4.325,1.825)
  oval 1.2x1.8 hole 0.6x1.2: 13(-4.325,-2.375) 14(4.325,-2.375)

## Nets
As in the schematic.

Pads without a net: U1 2 12 15 16 17 18 19 21 25 26 27 28 29 32 33 38 39 40 41 45 46; U4 4; USB1 3 9

## Via types
v1: diameter 0.61, hole 0.305, Top Layer to Bottom Layer, 94 vias
v2: diameter 1.219, hole 0.61, Top Layer to Bottom Layer, 2 vias

## Routing (per net, layer and track width the routed paths; a pad name or vN(x,y) marks a point on that pad's centre or on a via; arc(x,y) is an arc through that point)
3V3: length 151.7
  Top Layer w0.254: C11.1 10.39,22.63 10.98,22.63 11.65,21.96 ; U1.36 21.34,17.93 ; 22.52,22.18 17.36,27.33 14.99,27.33 13.84,26.19 13.84,25.42 U1.1 15.19,24.08 15.89,24.08 U1.48 ; U1.24 12.94,13.35 12.94,13.2
  Top Layer w0.406: C12.1 9.53,18.59 9.53,19.79 C11.1
  Top Layer w0.508: U4.8 21.45,5.99 23.06,7.6 23.06,9.29 22.56,9.8 U4.5 20.34,12.09 ; OLED1.6 24.86,53.54 25.87,52.53 29.91,52.53 R12.2 ; R12.2 R13.1 31.88,54.39 31.88,57.94 29.72,60.09 24.41,60.09 R5.2 SW2.2 SW2.1 ; R12.2 R16.1 ; R16.1 29.91,50.75 25.6,50.75 24.91,51.44 OLED1.9 ; R16.1 R15.1 ; R15.1 31.8,47.08 31.8,33.91 U2.2 26.45,29.36 26.2,29.61 C2.1 25.48,28.69 24.48,27.69 24.48,24.11 C14.2 22.52,22.18 21.68,21.34 21.68,19.86 C13.2 22.52,19 21.34,17.82 21.34,12.85 20.59,12.11 C10.2 ; R15.1 29.91,48.97 25.98,48.97 24.92,50.04 OLED1.11 ; C12.1 12.94,13.2 16.87,13.2 18.12,11.95 20.16,11.95
5V: length 65.3
  Top Layer w0.406: 23.27,1.93 27.7,6.36 27.7,6.89 28.09,7.28 USB1.2
  Top Layer w0.508: USB1.11 27.7,12.08 27.31,12.47 27.31,14.5 29.97,17.17 ; D2.1 31.36,22.37 Q1.1 R4.1 29.97,19.37 29.97,17.17 ; 29.97,17.17 31.5,15.64 31.5,4.09 29.34,1.93 19.67,1.93 17.78,3.81 ; 17.78,3.81 17.78,4.98 17.27,5.5 17.27,6.22 17.78,6.72 17.78,9.55 17.15,10.18 14.35,10.18 13.46,11.07 13.46,11.31 ; 17.78,3.81 16.26,3.81
GND: length 5.7
  Top Layer w0.254: v1(20.45,16.41) 20.45,17.28 20.63,17.46 20.63,17.93 U1.35 ; C13.1 22.61,17.53 v1(22.61,16.41)
  Bottom Layer w0.254: v1(20.45,16.41) v1(22.61,16.41)
  vias: v1(5.44,66.4) v1(5.44,56.24) v1(5.44,51.16) v1(5.44,41) v1(5.44,35.92) v1(5.44,30.84) v1(5.44,25.76) v1(5.44,15.6) v1(5.44,5.44) v1(8.13,12.6) v1(10.52,66.4) v1(10.52,61.32) v1(10.52,56.24) v1(10.52,51.16) v1(10.52,46.08) v1(10.52,41) v1(10.52,35.92) v1(10.52,10.52) v1(10.52,5.44) v1(11.94,30.88) v1(15.52,18.01) v1(15.6,56.24) v1(15.6,51.16) v1(15.6,46.08) v1(15.6,41) v1(15.6,35.92) v1(15.6,30.84) v1(15.6,25.76) v1(18.54,13.48) v1(20.68,66.4) v1(20.68,35.92) v1(25.53,25.17) v1(25.76,15.6) v1(26.16,61.24) v1(27.18,26.82) v1(29.34,28.72) v1(30.84,66.4) v1(30.84,61.32) v1(33.53,32.07) v1(33.53,25.6) v1(33.53,22.38) v2(22.94,3.06)
VCC: length 11.6
  Top Layer w0.508: Q1.2 D1.2 30.35,26.82 D2.2 31.38,28.2 C1.2 C3.2 U2.3
ADC_VBAT: length 17.3
  Top Layer w0.254: R18.2 R19.2 24.9,19.83 v1(23.37,19.83) ; U1.14 12.36,19.83 v1(20.83,19.83)
  Bottom Layer w0.254: v1(23.37,19.83) v1(20.83,19.83)
BOOT0: length 7.2
  Top Layer w0.254: R6.2 21.76,23.78 v1(21.74,23.8) ; 18.01,23.37 17.15,22.5
  Bottom Layer w0.254: v1(17.15,22.5) 20.45,22.5 v1(21.74,23.8)
BOOT1: length 6.3
  Top Layer w0.254: U1.20 12.16,15.39 v1(12.06,15.39) ; v1(10.67,13.99) 10.56,13.99 R7.2
  Bottom Layer w0.254: v1(10.67,13.99) v1(12.06,15.39)
LIGHT: length 16.7
  Top Layer w0.254: R9.2 22.61,28.92 v1(22.61,28.72) ; 10.94,21.25 11.98,20.22 13.97,20.22 v1(16.26,22.5)
  Bottom Layer w0.254: v1(22.61,28.72) 22.61,28.66 18.56,24.61 18.36,24.61 v1(16.26,22.5)
NRST: length 72
  Top Layer w0.254: v1(30.1,34.69) 28.07,32.66 v1(24.38,32.66) ; U1.7 13.03,21.99 13.72,21.99 v1(15.11,23.39) ; 22.5,63.51 C9.2 27.45,66.6 SW1.1 SW1.2 33.53,57.32 v1(33.53,34.69)
  Bottom Layer w0.254: v1(30.1,34.69) v1(33.53,34.69) ; v1(15.11,23.39) v1(24.38,32.66)
OSC32_IN: length 9.4
  Top Layer w0.254: X2.2 17.05,30.91 C7.1 15.95,27.84 14.59,27.84 13.28,26.52 13.28,24.57 U1.3
OSC32_OUT: length 8.1
  Top Layer w0.254: X2.1 14.47,28.96 C8.1 12.83,27.31 12.83,24.32 U1.4
OSC_IN: length 10.8
  Top Layer w0.254: U1.5 11.05,25.39 11.05,27.58 10.67,27.96 9.27,27.96 X1.3 8.44,29.09 C5.2
OSC_OUT: length 5.9
  Top Layer w0.254: U1.6 11.39,24.34 C6.2 9.84,26.59 X1.1
SCL: length 33.5
  Top Layer w0.254: R15.2 26.45,45.14 v1(26.11,45.14) OLED1.18 ; U1.42 19.4,23.34 v1(19.71,23.34)
  Bottom Layer w0.254: v1(19.71,23.34) 26.11,29.73 v1(26.11,45.14)
SDA: length 36.5
  Top Layer w0.254: v1(19.04,23.99) 19.04,23.69 U1.43 ; OLED1.19 OLED1.20 v1(25.4,43.74) ; R16.2 v1(26.29,49.81)
  Bottom Layer w0.254: v1(26.29,49.81) 25.4,48.92 v1(25.4,43.74) 25.4,30.35 v1(19.04,23.99)
SWCLK: length 47.4
  Top Layer w0.254: U1.37 19.99,20.4 17.98,20.4 v1(17.91,20.47) ; J1.1 8.51,48.66 3.94,44.09 v1(3.94,20.47)
  Bottom Layer w0.254: v1(3.94,20.47) v1(17.91,20.47)
SWDIO: length 44.7
  Top Layer w0.254: U1.34 18.65,19.2 v1(17.91,19.2) ; J1.2 8.51,46.12 4.57,42.19 v1(4.57,19.2)
  Bottom Layer w0.254: v1(17.91,19.2) v1(4.57,19.2)
USART1_RX: length 12
  Top Layer w0.254: U4.6 v1(22.35,8.53) ; U1.31 20.45,15.28 v1(20.45,15.26)
  Bottom Layer w0.254: v1(22.35,8.53) 22.35,13.36 v1(20.45,15.26)
USART1_TX: length 12.2
  Top Layer w0.254: U4.7 v1(21.72,7.26) ; 18.37,16.65 19.43,15.59 v1(19.43,14.37)
  Bottom Layer w0.254: v1(19.43,14.37) 21.72,12.09 v1(21.72,7.26)
USART2_RX: length 64.7
  Top Layer w0.254: U1.13 10.03,18.22 v1(10.03,17.3) ; v1(3.46,10.69) 5.59,12.82 v1(5.59,12.85)
  Top Layer w0.508: v1(3.46,59.2) J3.3 ; J2.1 v1(3.46,10.69)
  Bottom Layer w0.254: v1(10.03,17.3) v1(5.59,12.85)
  Bottom Layer w0.508: v1(3.46,10.69) 1.4,12.75 1.4,57.14 v1(3.46,59.2)
USART3_RX: length 64.3
  Top Layer w0.254: v1(12.83,14.63) 12.83,14.65 U1.22
  Top Layer w0.508: J3.2 v1(6,59.2) ; v1(6,10.69) J2.2
  Bottom Layer w0.254: v1(6,10.69) 8.89,10.69 v1(12.83,14.63)
  Bottom Layer w0.508: v1(6,59.2) 3.05,56.25 3.05,13.64 v1(6,10.69)
V_BAT: length 38.5
  Top Layer w0.508: v2(20.34,3.06) 18.54,4.86 18.54,10.04 17.27,11.31 ; D1.1 26.88,25.42 Q1.3 26.88,22.46 v1(26.54,22.12) 27.31,21.36 R18.1
  Bottom Layer w0.508: v2(20.34,3.06) 24.13,6.85 24.13,19.71 v1(26.54,22.12)
WAKEUP: length 88.5
  Top Layer w0.254: v1(24.51,31.77) 26.54,31.77 26.6,31.83 27.9,31.83 27.96,31.77 28.32,31.77 v1(30.35,33.81) ; U1.10 11.42,21.6 11.91,21.11 12.26,21.11 12.75,21.6 14.34,21.6 v1(16.13,23.39) ; v1(34.29,33.81) 34.29,64.67 29.84,69.11 17.26,69.11 SW2.3 SW2.4 R8.2
  Bottom Layer w0.254: v1(30.35,33.81) v1(34.29,33.81) ; v1(16.13,23.39) v1(24.51,31.77)
$1N1063: length 1.7
  Top Layer w0.254: C4.1 16.2,2.37 R1.1
$1N1376: length 36.1
  Top Layer w0.254: LEDR1.2 LEDG1.2 34.16,19.73 34.16,17.55 32.18,15.57 32.18,3.76 29.59,1.17 18.93,1.17 R2.1
$1N1506: length 2.7
  Top Layer w0.254: 12.96,3.81 13.74,4.59 14.22,4.59 14.73,5.1 14.73,5.5
$1N2036: length 28.7
  Top Layer w0.254: U3.7 14.73,12.34 v1(14.73,12.34) ; LEDR1.1 v1(31.19,18.06)
  Bottom Layer w0.254: v1(14.73,12.34) 14.73,15.07 23.49,23.82 28.14,23.82 29.97,21.99 29.97,19.27 v1(31.19,18.06)
$1N2050: length 30.4
  Top Layer w0.254: LEDG1.1 v1(33.34,18.06) ; U3.6 v1(16,12.34)
  Bottom Layer w0.254: v1(16,12.34) 16,15.83 22.87,22.7 27.74,22.7 28.7,21.74 28.7,18.06 29.59,17.17 32.46,17.17 v1(33.34,18.06)
$1N6021: length 2.7
  Top Layer w0.254: R9.1 22.83,31.47 LEDB1.1
$1N7835: length 9.7
  Top Layer w0.254: R10.1 24.29,10.88 v1(25.84,10.88) ; USB1.4 29.21,8.43 29.72,7.91 v1(29.72,7.9)
  Bottom Layer w0.254: v1(25.84,10.88) 26.92,9.8 27.81,9.8 v1(29.72,7.9)
$1N7870: length 3.1
  Top Layer w0.254: USB1.10 26.41,11.43 R11.1
$1N7941: length 10.5
  Top Layer w0.254: USB1.8 v1(27.43,10.43) ; U4.1 26.42,5.99 27.27,6.85 27.27,8.88 27.81,9.43 USB1.6 v1(29.72,9.43)
  Bottom Layer w0.254: v1(27.43,10.43) 28.08,10.43 29.08,9.43 v1(29.72,9.43)
$1N7951: length 8.9
  Top Layer w0.254: USB1.5 29.39,8.93 29.48,8.84 29.96,8.84 30.3,9.18 30.3,9.67 29.96,10.01 29.48,10.01 29.39,9.93 USB1.7 28.61,9.93 27.81,9.93 26.91,9.03 26.91,7.89 26.29,7.26 U4.2
$1N11036: length 7
  Top Layer w0.254: OLED1.2 28.69,56.34 C15.2
$1N11072: length 6.8
  Top Layer w0.254: OLED1.4 29.19,54.94 C16.2
$1N11110: length 8.7
  Top Layer w0.254: 30.8,57.05 29.62,55.87 28.88,55.87 28.65,55.64 OLED1.3
$1N11115: length 8.4
  Top Layer w0.254: OLED1.5 29.89,54.24 30.8,55.14
$1N11234: length 25.8
  Top Layer w0.254: v1(27.18,47.27) 26.51,47.94 OLED1.14 ; D3.1 28.48,36.73 30.08,38.32 30.08,42.02 C17.2 28.51,41.81 v1(28.45,41.81) ; R12.1 v1(28.32,51.58)
  Bottom Layer w0.254: v1(28.32,51.58) 28.32,50.63 28.91,50.05 28.91,48.99 v1(27.18,47.27) 29.03,45.41 29.03,43.34 28.45,42.76 v1(28.45,41.81)
$1N11475: length 17.6
  Top Layer w0.254: v1(26.16,46.5) 25.43,47.24 OLED1.15 ; R14.2 28.46,43.58 v1(28.45,43.58) ; R13.2 v1(28.32,53.36)
  Bottom Layer w0.254: v1(28.32,53.36) 27.31,52.35 27.31,49.17 26.16,48.03 v1(26.16,46.5) 28.45,44.22 v1(28.45,43.58)
$1N11833: length 11.6
  Top Layer w0.254: R17.2 27.18,44.08 27.18,40.28 26.43,39.54 OLED1.26
$1N11913: length 7.5
  Top Layer w0.254: C18.1 27.44,38.84 OLED1.27
$1N12059: length 7
  Top Layer w0.254: C19.2 28.65,38.14 OLED1.28

## Copper pours and planes (outline as drawn; the poured copper is in the pictures)
GND on Top Layer: -0.38,70.38 35.31,70.38 35.31,-0.36 -0.38,-0.36
GND on Bottom Layer: -0.38,70.38 35.31,70.38 35.31,-0.36 -0.38,-0.36

Small or netless copper shapes (teardrops, artwork), in the pictures only: 204 on Top Layer, 54 on Bottom Layer
